# Altium schematic sheet LTM8056.SchDoc: FMC SDR Frontend
size 420 x 297 mm; CheckedBy: -; CompanyName: CERN; DrawnBy: DrawnBy; Organization: CERN; Address1: European Organization for Nuclear Research; Address2: CH-1211 Genčve 23 - Switzerland; Revision: -; SheetNumber: -; SheetTotal: -; EDA_Number: EDA-XXXXX-VX-X; Projet: -; ModifiedBy: -; CreateDate: XX/XX/XXXX; CheckedDate: -; Title2: PA Main Switching Regulator; DivGrp: TE/MPE; Designer: Designer; ModifiedDate: -
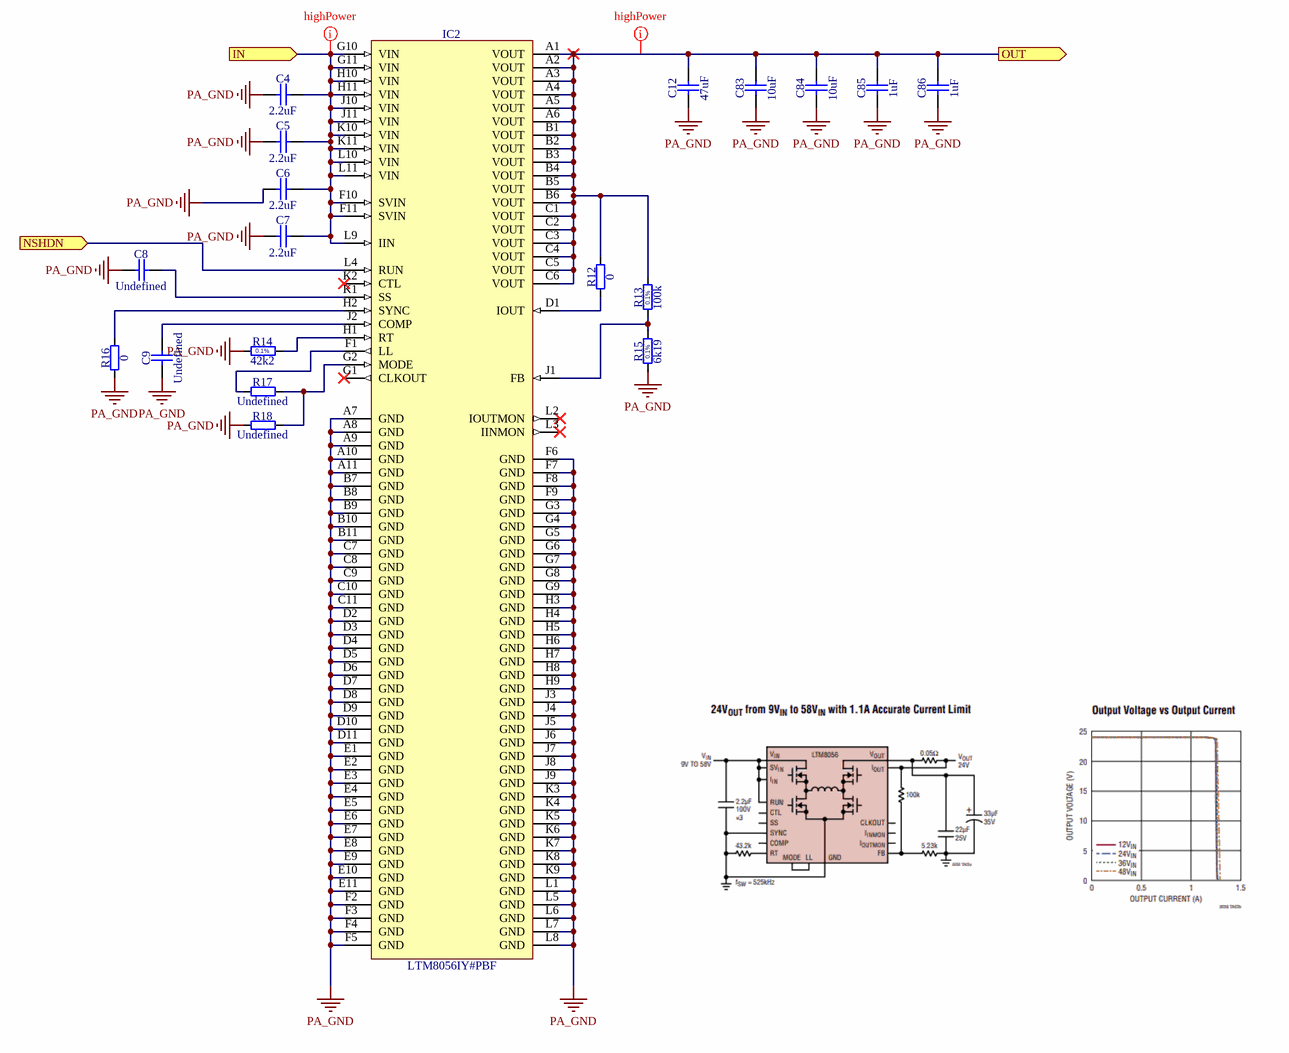
[diagram p0: LTM8056.SchDoc]

## Parts
C4  2.2uF  [CAPC3216X180N]
C5  2.2uF  [CAPC3216X180N]
C6  2.2uF  [CAPC3216X180N]
C7  2.2uF  [CAPC3216X180N]
C8  Undefined  [CAPC1608X90N]
C9  Undefined  [CAPC1608X90N]
C12  47uF  [CAPC_TDK_CKG57N]
C83  10uF  [CAPC3225X280N]
C84  10uF  [CAPC3225X280N]
C85  1uF  [CAPC1608X87N]
C86  1uF  [CAPC1608X87N]
IC2  LTM8056IY#PBF  [BGA121C127P11X11_1500X1500X512]
R12  0  [RESC1608X55N]
R13  100k  [RESC1608X55N]
R14  42k2  [RESC1608X55N]
R15  6k19  [RESC1608X55N]
R16  0  [RESC1608X55N]
R17  Undefined  [RESC1608X55N]
R18  Undefined  [RESC1608X55N]

## Ports
IN (in), NSHDN (in), OUT (out)

## Nets
PA_GND: C4.1 C5.1 C6.1 C7.1 C8.1 C9.1 C12.1 C83.1 C84.1 C85.1 C86.1 IC2.A7(GND) IC2.A8(GND) IC2.A9(GND) IC2.A10(GND) IC2.A11(GND) IC2.B7(GND) IC2.B8(GND) IC2.B9(GND) IC2.B10(GND) IC2.B11(GND) IC2.C7(GND) IC2.C8(GND) IC2.C9(GND) IC2.C10(GND) IC2.C11(GND) IC2.D2(GND) IC2.D3(GND) IC2.D4(GND) IC2.D5(GND) IC2.D6(GND) IC2.D7(GND) IC2.D8(GND) IC2.D9(GND) IC2.D10(GND) IC2.D11(GND) IC2.E1(GND) IC2.E2(GND) IC2.E3(GND) IC2.E4(GND) IC2.E5(GND) IC2.E6(GND) IC2.E7(GND) IC2.E8(GND) IC2.E9(GND) IC2.E10(GND) IC2.E11(GND) IC2.F2(GND) IC2.F3(GND) IC2.F4(GND) IC2.F5(GND) IC2.F6(GND) IC2.F7(GND) IC2.F8(GND) IC2.F9(GND) IC2.G3(GND) IC2.G4(GND) IC2.G5(GND) IC2.G6(GND) IC2.G7(GND) IC2.G8(GND) IC2.G9(GND) IC2.H3(GND) IC2.H4(GND) IC2.H5(GND) IC2.H6(GND) IC2.H7(GND) IC2.H8(GND) IC2.H9(GND) IC2.J3(GND) IC2.J4(GND) IC2.J5(GND) IC2.J6(GND) IC2.J7(GND) IC2.J8(GND) IC2.J9(GND) IC2.K3(GND) IC2.K4(GND) IC2.K5(GND) IC2.K6(GND) IC2.K7(GND) IC2.K8(GND) IC2.K9(GND) IC2.L1(GND) IC2.L5(GND) IC2.L6(GND) IC2.L7(GND) IC2.L8(GND) R14.1 R15.1 R16.1 R18.1
IN: C4.2 C5.2 C6.2 C7.2 IC2.F10(SVIN) IC2.F11(SVIN) IC2.G10(VIN) IC2.G11(VIN) IC2.H10(VIN) IC2.H11(VIN) IC2.J10(VIN) IC2.J11(VIN) IC2.K10(VIN) IC2.K11(VIN) IC2.L9(IIN) IC2.L10(VIN) IC2.L11(VIN) ; port IN
NSHDN: IC2.L4(RUN) ; port NSHDN
OUT: C12.2 C83.2 C84.2 C85.2 C86.2 IC2.A1(VOUT) IC2.A2(VOUT) IC2.A3(VOUT) IC2.A4(VOUT) IC2.A5(VOUT) IC2.A6(VOUT) IC2.B1(VOUT) IC2.B2(VOUT) IC2.B3(VOUT) IC2.B4(VOUT) IC2.B5(VOUT) IC2.B6(VOUT) IC2.C1(VOUT) IC2.C2(VOUT) IC2.C3(VOUT) IC2.C4(VOUT) IC2.C5(VOUT) IC2.C6(VOUT) R12.2 R13.2 ; port OUT
NetC8_2: C8.2 IC2.K1(SS)
NetC9_2: C9.2 IC2.J2(COMP)
NetIC2_D1: IC2.D1(IOUT) R12.1
NetIC2_F1: IC2.F1(LL) R17.1
NetIC2_G2: IC2.G2(MODE) R17.2 R18.2
NetIC2_H1: IC2.H1(RT) R14.2
NetIC2_H2: IC2.H2(SYNC) R16.2
NetIC2_J1: IC2.J1(FB) R13.1 R15.2

Not connected (* = marked no-connect by the designer): IC2 G1(CLKOUT)* K2(CTL)* L2(IOUTMON)* L3(IINMON)*

## Layout directives
net class highPower: IN, OUT

## Notes on the sheet
- Project/Equipment
- Document
- Designer
- Drawn by
- Check.by
- File
- Last Mod.
- Print Date
- Sheet
- Size
- A3
- of
- Rev
- (in symbol R0603_6K19_0.1%_0.063W_10PPM) 0.1%
- (in symbol R0603_42K2_0.1%_0.063W_10PPM) 0.1%
- (in symbol R0603_100K_0.1%_0.063W_10PPM) 0.1%

## Library data of the parts
C4-C7 = CC1206_2.2UF_50V_10%_X7R: Non-polarised capacitor; Part Description: SMD Multilayer Chip Ceramic Capacitor; Manufacturer: GENERIC; Manufacturer1 Part Number: C1206C225K5RACTU; Voltage: 50V; TC: X7R; Tolerance: ±10%; Part Number: CC1206_2.2UF_50V_10%_X7R; Component Kind: Standard; Component Type: Standard; Pin Count: 2; Value: 2.2uF; Status: Preferred; Manufacturer Part Number: CC1206_2.2uF_50V_10%_X7R; Case: 1206; Mounted: Yes; Socket: No; SMD: Yes; Sense: No; Manufacturer1 Example: KEMET; Manufacturer1 ComponentHeight: 1.8mm; HelpURL: \\cern.ch\dfs\Applications\Altium\Datasheets\CC1206_X7R_KEMET.pdf; Author: CERN DEM MR; CreateDate: 06.06.2016; LatestRevisionDate: 06.06.2016
C8 C9 = CC0603_NO-VALUE: Non-polarised capacitor; Part Description: Reserved Footprint For 0603(1608) Chip Ceramic Capacitor; Mounted: No; Part Number: CC0603_NO-VALUE; Component Kind: Standard; Component Type: Standard; Pin Count: 2; Value: Undefined; Status: None; Manufacturer: Undefined; Manufacturer Part Number: CC0603_NO-VALUE; Case: 0603; Socket: No; SMD: Yes; Sense: No; Manufacturer1 ComponentHeight: 0.9mm; HelpURL: Undefined; Author: CERN DEM MR; CreateDate: 22.11.2016; LatestRevisionDate: 22.11.2016
C12 = CC2220_47UF_25V_20%_X7S_TDK_CKG57N: Non-polarised capacitor; Part Description: Multilayer Ceramic Chip Capacitor - Stacked Cap, CKG57N Series; Manufacturer: TDK; Manufacturer Part Number: CKG57NX7S1E476M500JH; Voltage: 25V; TC: X7S; Tolerance: ±20%; Part Number: CC2220_47UF_25V_20%_X7S_TDK_CKG57N; Component Kind: Standard; Component Type: Standard; Pin Count: 2; Value: 47uF; Status: None; Case: 2220; Mounted: Yes; Socket: No; SMD: Yes; Sense: No; ComponentHeight: 5.5mm; HelpURL: \\cern.ch\dfs\Applications\Altium\Datasheets\CC2220_X7S_TDK_CKG.pdf; Author: CERN DEM JLC; CreateDate: 21.10.2014; LatestRevisionDate: 18.12.2017
C83 C84 = CC1210_10UF_50V_10%_X7R_YUDEN_UMK325AB7106KMHP: Non-polarised capacitor; Part Description: SMD Multilayer Chip Ceramic Capacitor (High Dielectric Type) for Automotive / Industrial Applications; Manufacturer: TAIYO YUDEN; Voltage: 50V; TC: X7R; Tolerance: ±10%; Part Number: CC1210_10UF_50V_10%_X7R_YUDEN_UMK325AB7106KMHP; Component Kind: Standard; Component Type: Standard; Pin Count: 2; Value: 10uF; Status: Not Recommended; Manufacturer Part Number: UMK325AB7106KMHP; Case: 1210; Mounted: Yes; Socket: No; SMD: Yes; Sense: No; ComponentHeight: 2.8mm; HelpURL: \\cern.ch\dfs\Applications\Altium\Datasheets\CC1210_TAIYO-YUDEN_UMK325AB7106KMHP.pdf; Author: CERN DEM JLC; CreateDate: 30.11.2016; LatestRevisionDate: 30.12.2015
C85 C86 = CC0603_1UF_50V_10%_X5R: Non-polarised capacitor; Part Description: SMD Multilayer Chip Ceramic Capacitor; Manufacturer: GENERIC; Manufacturer1 Part Number: C1608X5R1H105K080; Voltage: 50V; TC: X5R; Tolerance: ±10%; Part Number: CC0603_1UF_50V_10%_X5R; Component Kind: Standard; Component Type: Standard; Pin Count: 2; Value: 1uF; Status: None; Manufacturer Part Number: CC0603_1UF_50V_10%_X5R; Case: 0603; Mounted: Yes; Socket: No; SMD: Yes; Sense: No; Manufacturer1 Example: TDK; Manufacturer1 ComponentHeight: 0.9mm; HelpURL: \\cern.ch\dfs\Applications\Altium\Datasheets\CC0603_X5R_TDK_C.pdf; Author: CERN DEM JMW; CreateDate: 09.11.2015; LatestRevisionDate: 09.11.2015
IC2 = LTM8056IY#PBF: 58VIN, 48VOUT Buck-Boost µModule Regulator; Manufacturer: LINEAR TECHNOLOGY; PressFit: No; Bonding: No; Part Number: LTM8056IY#PBF; Component Kind: Standard; Component Type: Standard; Device: LTM8056IY#PBF; PackageDescription: BGA,1.27mm Pitch, Square;121 Pin, 11 Columns X 11 Rows, 15.00mm X 15.00mm X 5.12mm H; Part Description: 58VIN, 48VOUT Buck-Boost µModule Regulator; Manufacturer Part Number: LTM8056IY#PBF; Pin Count: 121; Case: BGA121; Mounted: Yes; Socket: No; SMD: Yes; Sense: No; ComponentHeight: 5.12mm; HelpURL: \\cern.ch\dfs\Applications\Altium\Datasheets\LTM8056IY#PBF.pdf; Author: CERN DEM JLC; CreateDate: 08.04.2019; LatestRevisionDate: 08.04.2019
R12 R16 = R0603_0R_JUMPER: Resistor; Part Description: 1A (0.05R Max DC Resistance) Zero Ohm Jumper; Manufacturer: GENERIC; Manufacturer1 Part Number: NRC06Z0; PressFit: No; Part Number: R0603_0R_JUMPER; Component Kind: Standard; Component Type: Standard; Pin Count: 2; Value: 0; Status: Preferred; Manufacturer Part Number: R0603_0R_JUMPER; Case: 0603; Mounted: Yes; Sense: No; Socket: No; SMD: Yes; Manufacturer1 Example: NIC COMPONENT; Manufacturer1 ComponentHeight: 0.55mm; HelpURL: \\cern.ch\dfs\Applications\Altium\Datasheets\R0603_NIC_NRC.pdf; Author: CERN DEM JLC; CreateDate: 03.12.2007; LatestRevisionDate: 13.03.2008
R13 = R0603_100K_0.1%_0.063W_10PPM: Resistor - 0.1%; Part Description: Thin Film Chip Resistor; Manufacturer: GENERIC; Manufacturer1 Part Number: RN73C1J100KBTDF; Power: 0.063W; TC: ±10ppm; PressFit: No; Part Number: R0603_100K_0.1%_0.063W_10PPM; Component Kind: Standard; Component Type: Standard; Pin Count: 2; Value: 100k; Status: Not Recommended; Tolerance: ±0.1%; Manufacturer Part Number: R0603_100K_0.1%_0.063W_10PPM; Case: 0603; Mounted: Yes; Sense: No; Socket: No; SMD: Yes; Manufacturer1 Example: TYCO HOLSWORTHY; Manufacturer1 ComponentHeight: 0.55mm; HelpURL: \\cern.ch\dfs\Applications\Altium\Datasheets\R0603_Tyco_RN73.pdf; Author: CERN DEM JLC; CreateDate: 03.12.2007; LatestRevisionDate: 13.03.2008
R14 = R0603_42K2_0.1%_0.063W_10PPM: Resistor - 0.1%; Part Description: Thin Film Chip Resistor; Manufacturer: GENERIC; Manufacturer1 Part Number: RN73C1J42K2BTDF; Power: 0.063W; TC: ±10ppm; PressFit: No; Part Number: R0603_42K2_0.1%_0.063W_10PPM; Component Kind: Standard; Component Type: Standard; Pin Count: 2; Value: 42k2; Status: Not Recommended; Tolerance: ±0.1%; Manufacturer Part Number: R0603_42K2_0.1%_0.063W_10PPM; Case: 0603; Mounted: Yes; Sense: No; Socket: No; SMD: Yes; Manufacturer1 Example: TYCO HOLSWORTHY; Manufacturer1 ComponentHeight: 0.5mm; HelpURL: \\cern.ch\dfs\Applications\Altium\Datasheets\R0603_Tyco_RN73.pdf; Author: CERN DEM JLC; CreateDate: 03.12.2007; LatestRevisionDate: 13.03.2008
R15 = R0603_6K19_0.1%_0.063W_10PPM: Resistor - 0.1%; Part Description: Thin Film Chip Resistor; Manufacturer: GENERIC; Manufacturer1 Part Number: RN73C1J6K19BTDF; Power: 0.063W; TC: ±10ppm; PressFit: No; Part Number: R0603_6K19_0.1%_0.063W_10PPM; Component Kind: Standard; Component Type: Standard; Pin Count: 2; Value: 6k19; Status: Not Recommended; Tolerance: ±0.1%; Manufacturer Part Number: R0603_6K19_0.1%_0.063W_10PPM; Case: 0603; Mounted: Yes; Sense: No; Socket: No; SMD: Yes; Manufacturer1 Example: TYCO HOLSWORTHY; Manufacturer1 ComponentHeight: 0.5mm; HelpURL: \\cern.ch\dfs\Applications\Altium\Datasheets\R0603_Tyco_RN73.pdf; Author: CERN DEM JLC; CreateDate: 03.12.2007; LatestRevisionDate: 13.03.2008
R17 R18 = R0603_NO-VALUE: Resistor; Part Description: Reserved Footprint For a 0603 (1608) Chip Resistor; PressFit: No; Mounted: No; Part Number: R0603_NO-VALUE; Component Kind: Standard; Component Type: Standard; Pin Count: 2; Value: Undefined; Status: None; Manufacturer: Undefined; Manufacturer Part Number: R0603_NO-VALUE; Case: 0603; Sense: No; Socket: No; SMD: Yes; Manufacturer1 Example: Undefined; Manufacturer1 Part Number: Undefined; Manufacturer1 ComponentHeight: Undefined; HelpURL: Undefined; Author: CERN DEM JLC; CreateDate: 03.12.2007; LatestRevisionDate: 13.03.2008